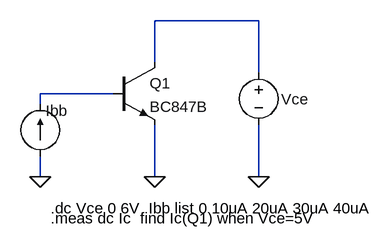
[diagram p0: schematic BT-CE-OUT-1.asc]
BT-CE-OUT-1.asc, the LTspice schematic file:
Version 4
SHEET 1 880 680
WIRE 368 16 208 16
WIRE 208 80 208 16
WIRE 368 96 368 16
WIRE 144 128 32 128
WIRE 32 144 32 128
WIRE 32 256 32 224
WIRE 208 256 208 176
WIRE 368 256 368 176
FLAG 208 256 0
FLAG 32 256 0
FLAG 368 256 0
SYMBOL voltage 368 80 R0
WINDOW 3 35 66 Invisible 2
WINDOW 123 0 0 Left 2
WINDOW 39 0 0 Left 2
WINDOW 0 35 57 Left 2
SYMATTR Value 0
SYMATTR InstName Vce
SYMBOL npn 144 80 R0
SYMATTR InstName Q1
SYMATTR Value BC847B
SYMBOL current 32 224 R180
WINDOW 0 -42 70 Left 2
WINDOW 3 -66 28 Invisible 2
WINDOW 123 0 0 Left 2
WINDOW 39 0 0 Left 2
SYMATTR InstName Ibb
SYMATTR Value 0
TEXT 48 304 Left 2 !.dc Vce 0 6V  Ibb list 0 10uA 20uA 30uA 40uA
TEXT 48 320 Left 2 !.meas dc Ic  find Ic(Q1) when Vce=5V

The netlist it stands for:
* BT-CE-OUT-1.asc
Vce N001 0 0
Q1 N001 N002 0 0 BC847B
Ibb 0 N002 0
.model NPN NPN
.model PNP PNP
.lib standard.bjt
.dc Vce 0 6V  Ibb list 0 10uA 20uA 30uA 40uA
.meas dc Ic  find Ic(Q1) when Vce=5V
.backanno
.end